# EAGLE design BMS_MCUV1.0 (EAGLE 9.1.3)
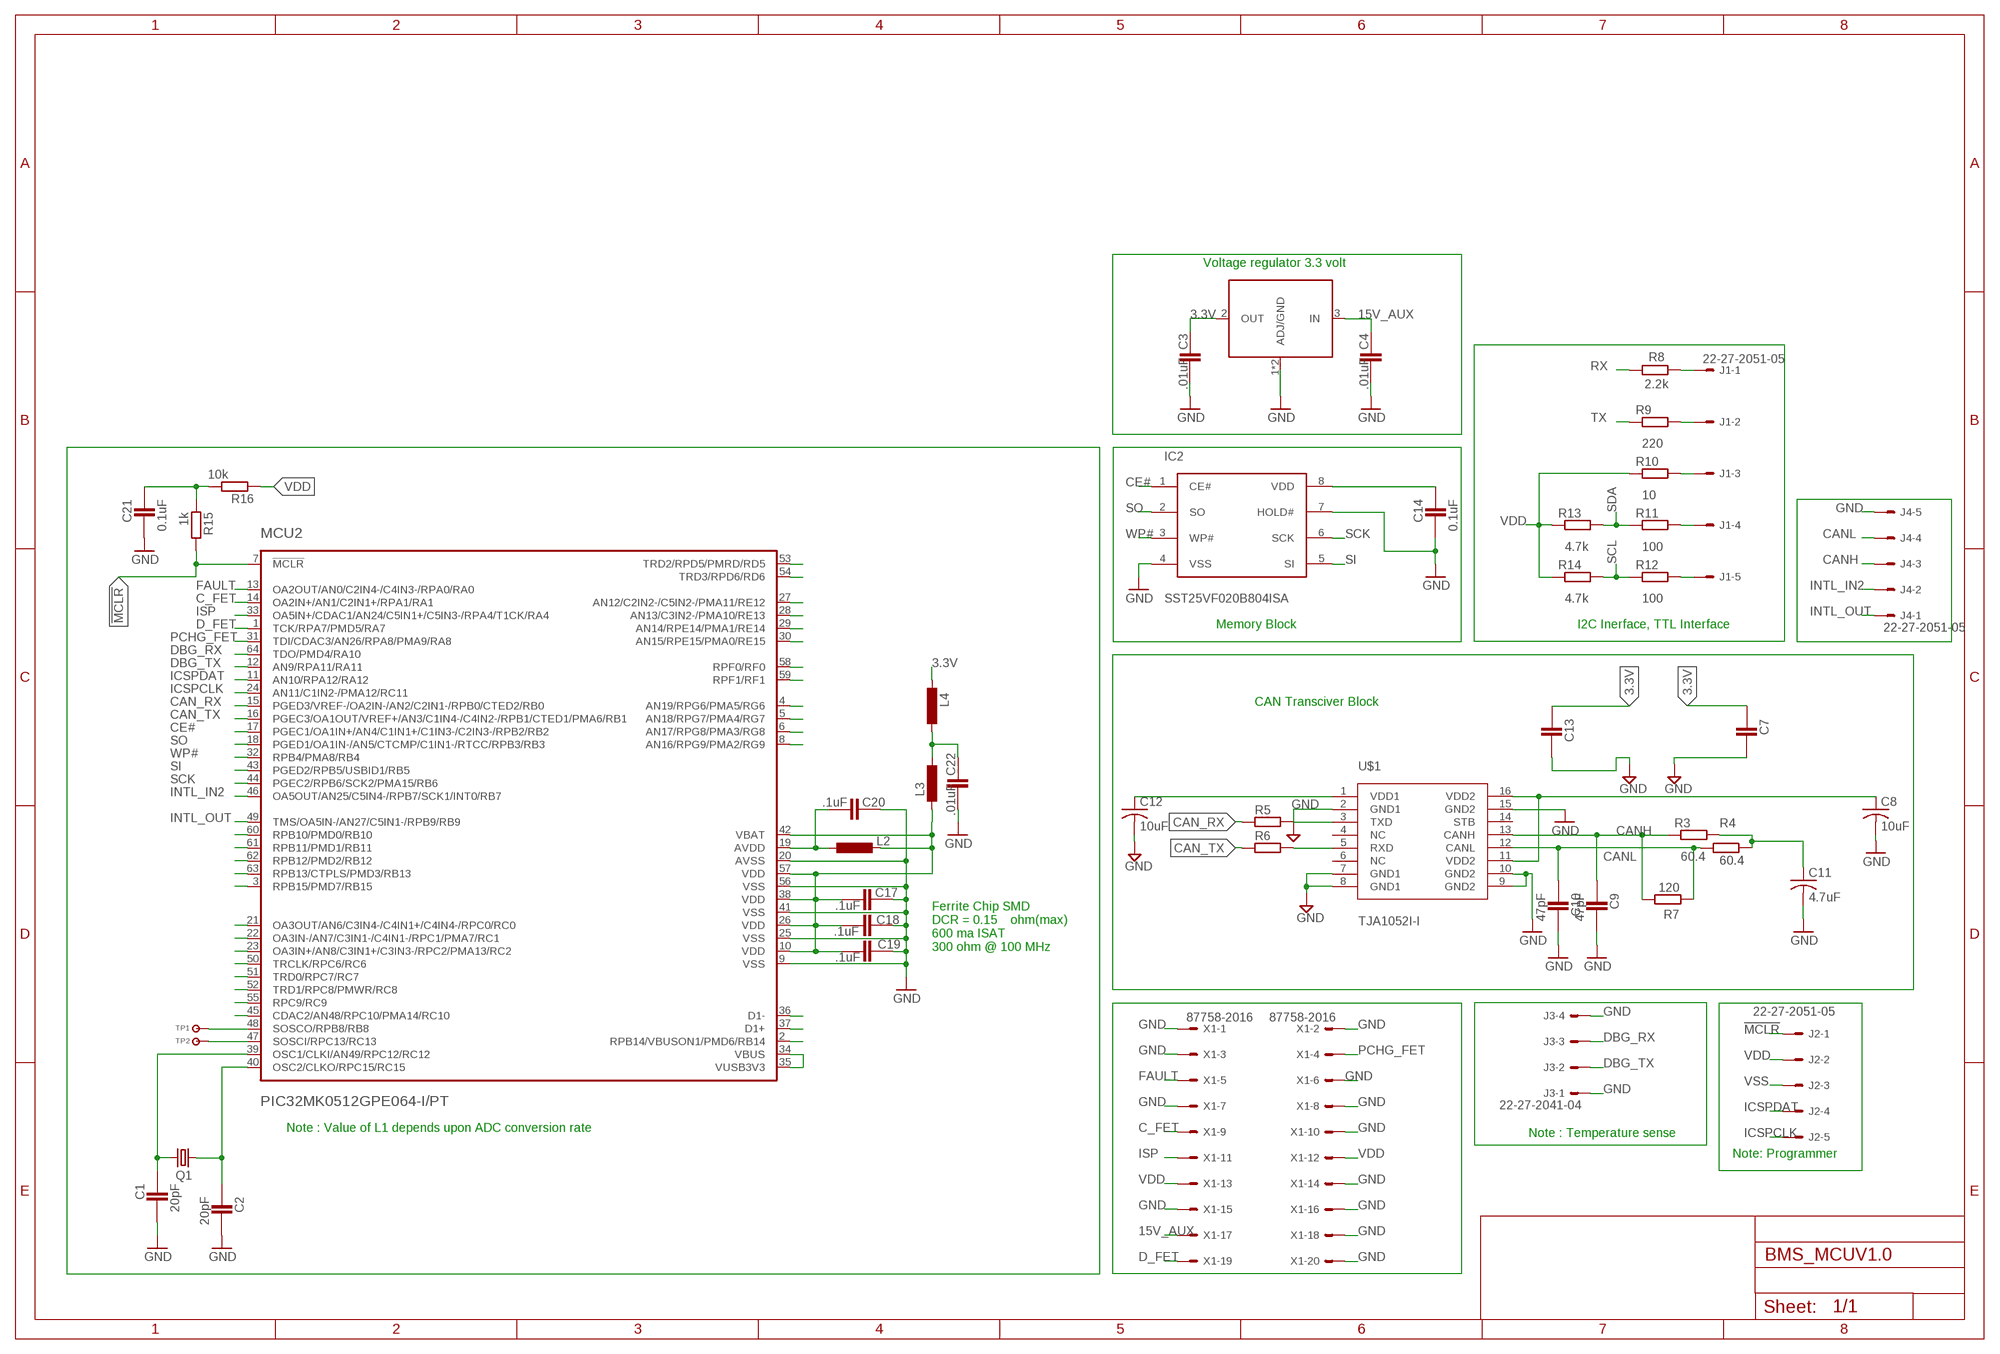
[diagram p0: schematic, sheet 1]

## Parts
C1  20pF  CAPACITOR_0603  [CAPC1608X92N]
C2  20pF  CAPACITOR_0603  [CAPC1608X92N]
C3  .01uF  CAPACITOR_0603  [CAPC1608X92N]
C4  .01uF  CAPACITOR_0603  [CAPC1608X92N]
C7  CAPACITOR_0805  [CAPC2012X145AN]
C8  10uF  C-USC0805  [C0805]
C9  47pF  CAPACITOR_0805  [CAPC2012X145AN]
C10  47pF  CAPACITOR_0805  [CAPC2012X145AN]
C11  4.7uF  C-USC0805  [C0805]
C12  10uF  C-USC0805  [C0805]
C13  CAPACITOR_0805  [CAPC2012X145AN]
C14  0.1uF  CAPACITOR_0603  [CAPC1608X92N]
C17  .1uF  CAPACITOR_0603  [CAPC1608X92N]
C18  .1uF  CAPACITOR_0603  [CAPC1608X92N]
C19  .1uF  CAPACITOR_0603  [CAPC1608X92N]
C20  .1uF  CAPACITOR_0603  [CAPC1608X92N]
C21  0.1uF  CAPACITOR_0603  [CAPC1608X92N]
C22  .01uF  CAPACITOR_0603  [CAPC1608X92N]
IC2  SST25VF020B804ISA  [SOIC127P600X175-8N]
J1  22-27-2051-05  [6410-05]
J2  22-27-2051-05  [6410-05]
J3  22-27-2041-04  [6410-04]
J4  22-27-2051-05  [6410-05]
L2  INDUCTOR_0603  [INDC1608X95N]
L3  INDUCTOR_0603  [INDC1608X95N]
L4  INDUCTOR_0603  [INDC1608X95N]
MCU2  PIC32MK0512GPE064-I/PT  [TQFP-64-I/PT]
Q1  CRYSTALCTS406  [CTS406]
R3  60.4  RESISTOR_0805  [RESC2012X70N]
R4  60.4  RESISTOR_0805  [RESC2012X70N]
R5  RESISTOR_0805  [RESC2012X70N]
R6  RESISTOR_0805  [RESC2012X70N]
R7  120  RESISTOR_0805  [RESC2012X70N]
R8  2.2k  RESISTOR_0805  [RESC2012X70N]
R9  220  RESISTOR_0805  [RESC2012X70N]
R10  10  RESISTOR_0805  [RESC2012X70N]
R11  100  RESISTOR_0805  [RESC2012X70N]
R12  100  RESISTOR_0805  [RESC2012X70N]
R13  4.7k  RESISTOR_0805  [RESC2012X70N]
R14  4.7k  RESISTOR_0805  [RESC2012X70N]
R15  1k  RESISTOR_0603  [RESC1608X55N]
R16  10k  RESISTOR_0603  [RESC1608X55N]
TP1  TP-SMD60  [TP-SMD60]
TP2  TP-SMD60  [TP-SMD60]
U1  NCP1117LP-PG  [SOT-223]
U$1  TJA1052I-I  [SOT162-1]
X1  87758-2016  [87758-2016]

## Nets
3.3V: C3.2 C7.1 C13.1 L4.1 U1.2(OUT)
15V_AUX: C4.2 U1.3(IN) X1.17
!MCLR: J2.1 MCU2.7(!MCLR) R15.2
C_FET: MCU2.14(OA2IN+/AN1/C2IN1+/RPA1/RA1) X1.9
CAN_RX: MCU2.15(PGED3/VREF-/OA2IN-/AN2/C2IN1-/RPB0/CTED2/RB0) R5.1
CAN_TX: MCU2.16(PGEC3/OA1OUT/VREF+/AN3/C1IN4-/C4IN2-/RPB1/CTED1/PMA6/RB1) R6.1
CANH: C9.1 J4.3 R3.1 R7.2 U$1.13(CANH)
CANL: C10.1 J4.4 R4.1 R7.1 U$1.12(CANL)
CE#: IC2.1(CE#) MCU2.17(PGEC1/OA1IN+/AN4/C1IN1+/C1IN3-/C2IN3-/RPB2/RB2)
D_FET: MCU2.1(TCK/RPA7/PMD5/RA7) X1.19
DBG_RX: J3.3 MCU2.64(TDO/PMD4/RA10)
DBG_TX: J3.2 MCU2.12(AN9/RPA11/RA11)
FAULT: MCU2.13(OA2OUT/AN0/C2IN4-/C4IN3-/RPA0/RA0) X1.5
GND: C1.2 C2.2 C3.1 C4.1 C7.2 C8.2 C9.2 C10.2 C11.2 C12.2 C13.2 C14.2 C17.2 C18.2 C19.2 C20.2 C21.2 C22.1 IC2.4(VSS) IC2.7(HOLD#) J3.1 J3.4 J4.5 MCU2.9(VSS) MCU2.20(AVSS) MCU2.25(VSS) MCU2.41(VSS) MCU2.56(VSS) U1.1(ADJ/GND) U1.4(ADJ/GND) U$1.2(GND1) U$1.7(GND1) U$1.8(GND1) U$1.9(GND2) U$1.10(GND2) U$1.15(GND2) X1.1 X1.2 X1.3 X1.6 X1.7 X1.8 X1.10 X1.14 X1.15 X1.16 X1.18 X1.20
ICSPCLK: J2.5 MCU2.24(AN11/C1IN2-/PMA12/RC11)
ICSPDAT: J2.4 MCU2.11(AN10/RPA12/RA12)
INTL_IN2: J4.2 MCU2.46(OA5OUT/AN25/C5IN4-/RPB7/SCK1/INT0/RB7)
INTL_OUT: J4.1 MCU2.49(TMS/OA5IN-/AN27/C5IN1-/RPB9/RB9)
ISP: MCU2.33(OA5IN+/CDAC1/AN24/C5IN1+/C5IN3-/RPA4/T1CK/RA4) X1.11
N$1: C1.1 MCU2.39(OSC1/CLKI/AN49/RPC12/RC12) Q1.3
N$2: C2.1 MCU2.40(OSC2/CLKO/RPC15/RC15) Q1.1
N$5: MCU2.48(SOSCO/RPB8/RB8) TP1.P$1
N$6: R6.2 U$1.5(RXD)
N$7: R5.2 U$1.3(TXD)
N$8: C12.1 U$1.1(VDD1)
N$9: MCU2.53(TRD2/RPD5/PMRD/RD5)
N$10: MCU2.54(TRD3/RPD6/RD6)
N$11: C11.1 R3.2 R4.2
N$12: C8.1 U$1.11(VDD2) U$1.16(VDD2)
N$14: C14.1 IC2.8(VDD)
N$16: MCU2.47(SOSCI/RPC13/RC13) TP2.P$1
N$18: J1.1 R8.2
N$19: J1.2 R9.2
N$20: J1.3 R10.2
N$21: J1.4 R11.2
N$22: J1.5 R12.2
N$29: MCU2.27(AN12/C2IN2-/C5IN2-/PMA11/RE12)
N$30: MCU2.28(AN13/C3IN2-/PMA10/RE13)
N$32: C20.1 L2.1 MCU2.19(AVDD)
N$33: C22.2 L3.2 L4.2
N$34: C21.1 R15.1 R16.2
N$40: MCU2.29(AN14/RPE14/PMA1/RE14)
N$41: MCU2.30(AN15/RPE15/PMA0/RE15)
N$42: MCU2.58(RPF0/RF0)
N$43: MCU2.59(RPF1/RF1)
N$44: MCU2.4(AN19/RPG6/PMA5/RG6)
N$45: MCU2.5(AN18/RPG7/PMA4/RG7)
N$46: MCU2.6(AN17/RPG8/PMA3/RG8)
N$47: MCU2.8(AN16/RPG9/PMA2/RG9)
N$66: MCU2.60(RPB10/PMD0/RB10)
N$67: MCU2.61(RPB11/PMD1/RB11)
N$68: MCU2.62(RPB12/PMD2/RB12)
N$69: MCU2.63(RPB13/CTPLS/PMD3/RB13)
N$70: MCU2.3(RPB15/PMD7/RB15)
N$71: MCU2.21(OA3OUT/AN6/C3IN4-/C4IN1+/C4IN4-/RPC0/RC0)
N$72: MCU2.22(OA3IN-/AN7/C3IN1-/C4IN1-/RPC1/PMA7/RC1)
N$73: MCU2.23(OA3IN+/AN8/C3IN1+/C3IN3-/RPC2/PMA13/RC2)
N$74: MCU2.50(TRCLK/RPC6/RC6)
N$75: MCU2.51(TRD0/RPC7/RC7)
N$76: MCU2.52(TRD1/RPC8/PMWR/RC8)
N$77: MCU2.55(RPC9/RC9)
N$78: MCU2.45(CDAC2/AN48/RPC10/PMA14/RC10)
N$79: MCU2.36(D1-)
N$80: MCU2.37(D1+)
N$81: MCU2.2(RPB14/VBUSON1/PMD6/RB14)
N$82: MCU2.34(VBUS) MCU2.35(VUSB3V3)
PCHG_FET: MCU2.31(TDI/CDAC3/AN26/RPA8/PMA9/RA8) X1.4
RX: R8.1
SCK: IC2.6(SCK) MCU2.44(PGEC2/RPB6/SCK2/PMA15/RB6)
SCL: R12.1 R14.2
SDA: R11.1 R13.2
SI: IC2.5(SI) MCU2.43(PGED2/RPB5/USBID1/RB5)
SO: IC2.2(SO) MCU2.18(PGED1/OA1IN-/AN5/CTCMP/C1IN1-/RTCC/RPB3/RB3)
TX: R9.1
VDD: C17.1 C18.1 C19.1 J2.2 L2.2 L3.1 MCU2.10(VDD) MCU2.26(VDD) MCU2.38(VDD) MCU2.42(VBAT) MCU2.57(VDD) R10.1 R13.1 R14.1 R16.1 X1.12 X1.13
VSS: J2.3
WP#: IC2.3(WP#) MCU2.32(RPB4/PMA8/RB4)
Unconnected: U$1.4(NC) U$1.6(NC) U$1.14(STB)

## Notes on the sheet
- Voltage regulator 3.3 volt
- Memory Block | I2C Inerface, TTL Interface
- CAN Transciver Block
- Ferrite Chip SMD
  DCR = 0.15ȍ ohm(max)
  600 ma ISAT
  300 ohm @ 100 MHz
- Note : Value of L1 depends upon ADC conversion rate
- Note : Temperature sense
- Note: Programmer

## Library data of the parts
C1-C4 C7 C9 C10 C13 C14 C17-C22 = ipc-7351-capacitor:CAPACITOR_
C8 C11 C12 = adafruit:C-US: CAPACITOR, American symbol
IC2 = GreenFuel:SST25VF020B804ISA
J1 J2 J4 = con-molex:22-?-05: CONNECTOR wire to board 2.54 mm (.1 inch) pitch header; MF: MOLEX; OC_FARNELL: unknown; OC_NEWARK: unknown
J3 = con-molex:22-?-04: CONNECTOR wire to board 2.54 mm (.1 inch) pitch header; MF: MOLEX; OC_FARNELL: unknown; OC_NEWARK: unknown
L2-L4 = ipc-7351-inductor:INDUCTOR_
MCU2 = GreenFuel:PIC32MK0512GPE064-I/PT
Q1 = adafruit:CRYSTAL: CRYSTAL; OC_FARNELL: unknown; OC_NEWARK: unknown
R3-R16 = ipc-7351-resistor:RESISTOR_
TP1 TP2 = simpa:TP
U1 = GreenFuel:NCP1117LP
U$1 = GreenFuel:TJA1052I: TJA1052i - Galvanically isolated high-speed CAN transceiver Specification : Type : SOT162-1 Manufacture : NXP Manufacture PN: TJA1052i Certifications: ISO 11898-2:2003 compliant Suitable for use in 12 V and 24 V systems; compatible with 3 V to 5 V microcontrollers Supporting Material TJA1052i Datasheet <https://www.nxp.com/docs/en/data-sheet/TJA1052I.pdf>
X1 = con-molex:87758-2016: 20 Pin - 2mm Dual Row Single Wafer, Vertical T/H HDR Source: http://www.molex.com/pdm_docs/sd/877580616_sd.pdf; MF: MOLEX; MPN: 87758-2016; OC_FARNELL: 7472374; OC_NEWARK: 25M5677

## Board
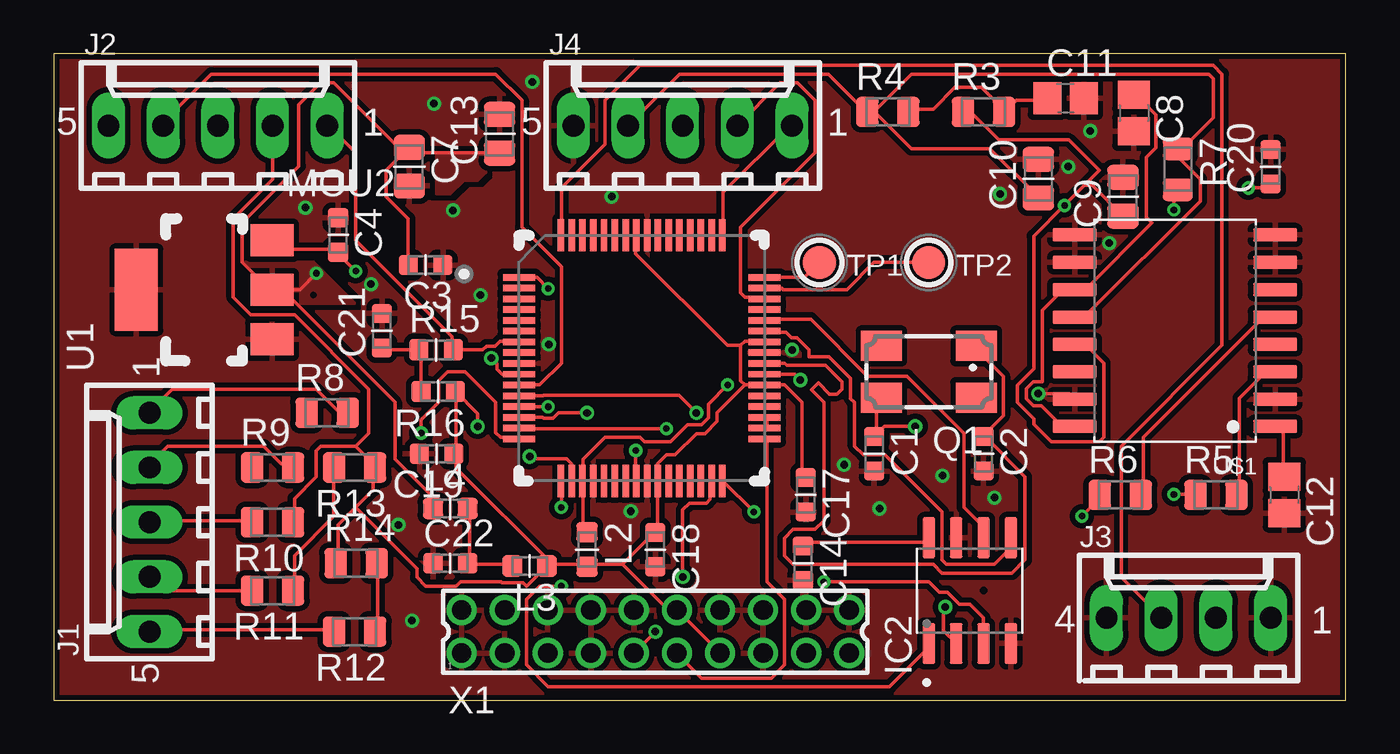
[diagram p1: board, top side]
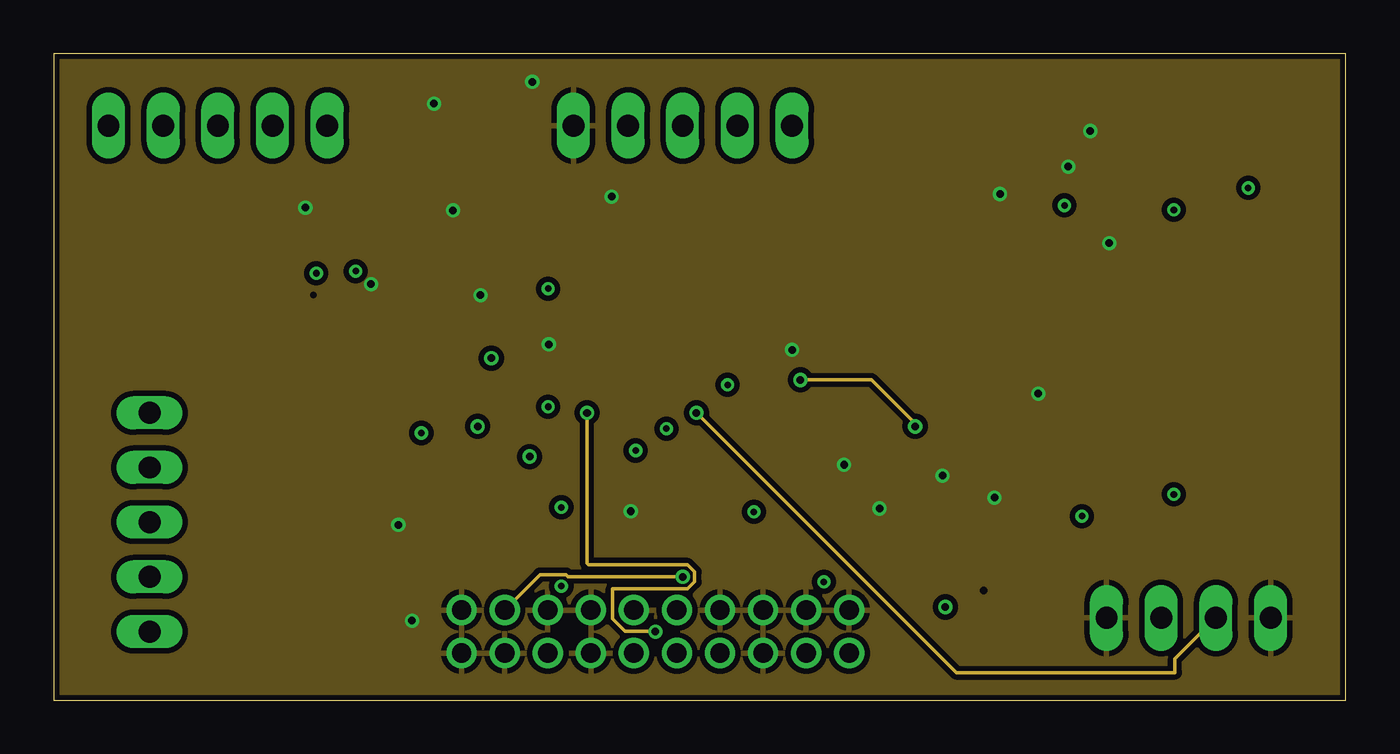
[diagram p2: board, inner layer Route2]
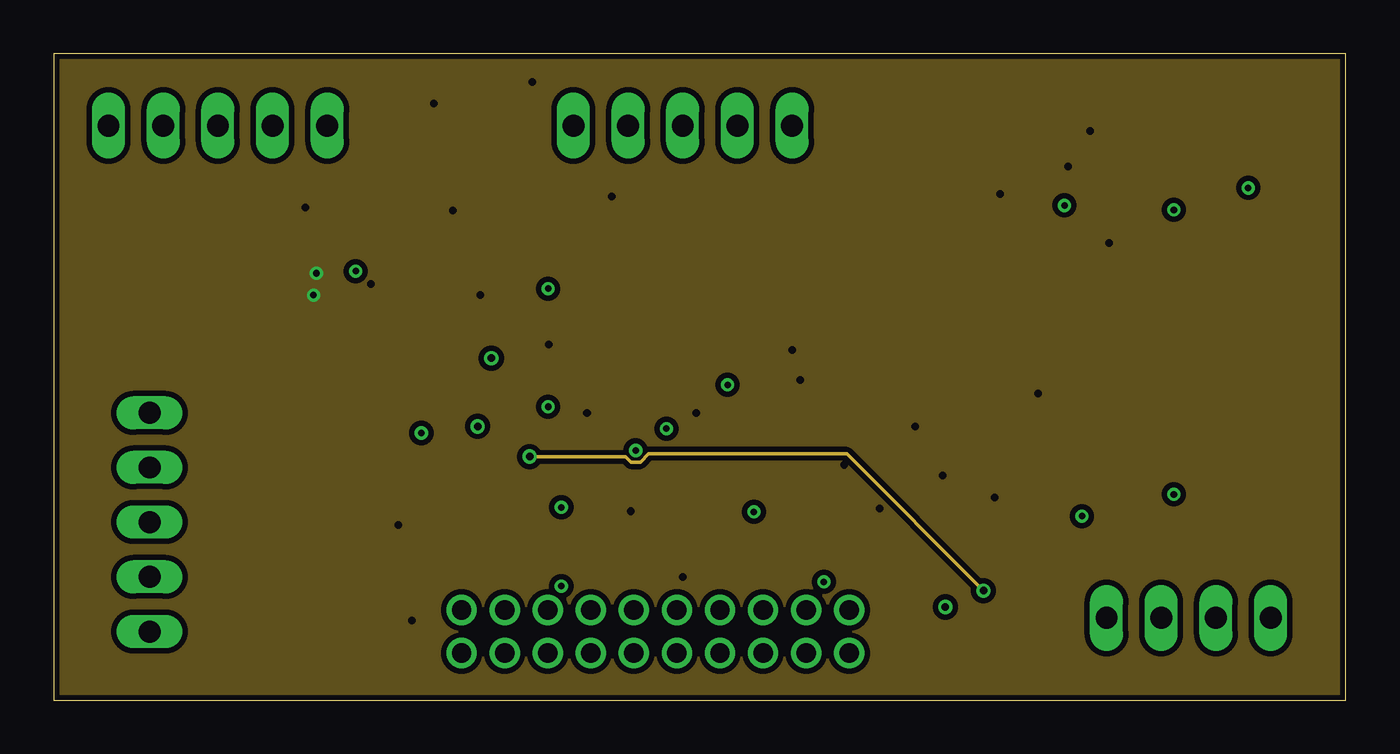
[diagram p3: board, inner layer Route15]
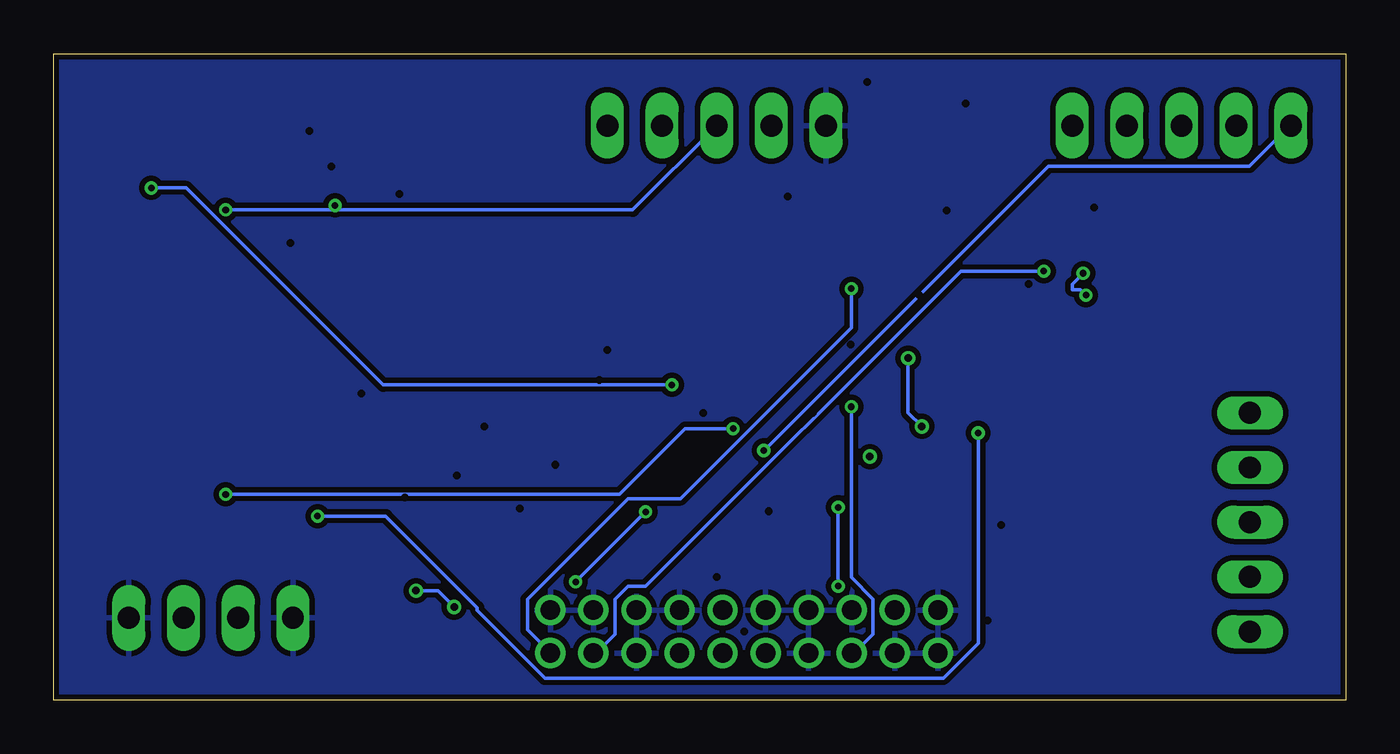
[diagram p4: board, bottom side, seen from below]

Size 60 x 30 mm. Coordinates in mm from the lower left corner, seen from the top.
Outline: 0,0 60,0 60,30 0,30 0,0
Copper layers [15:((1+2)*(15+16)):2]: Top 0.035mm / dielectric 0.09238125mm / Route2 0.035mm / dielectric 1.2304mm / Route15 0.035mm / dielectric 0.09238125mm / Bottom 0.035mm
Design rules "default *": minimum track width 6mil, minimum drill 12mil, track to track 10mil, track to pad 8mil, pad to pad 6mil, via to via 10mil, smd to smd 0mil, copper to edge 10mil, drill to drill 10mil, minimum pad ring 10mil, minimum via ring 6mil, stop-mask expansion 2mil, vias tented up to drill 100mil, thermal gap 10mil

### Footprints (pad centres in the part's own frame; a part is rotated, then mirrored left to right if it is on the bottom)
CAPC1608X92N = smd 0.9 x 0.95: 1 -0.8,0; 2 0.8,0
CAPC2012X145AN = smd 1.15 x 1.45: 1 -0.9,0; 2 0.9,0
C0805 = smd 1.3 x 1.5: 1 -0.85,0; 2 0.85,0
SOIC127P600X175-8N = smd 1.9 x 0.6: 1 -2.455,1.905; 2 -2.455,0.635; 3 -2.455,-0.635; 4 -2.455,-1.905; 5 2.455,-1.905; 6 2.455,-0.635; 7 2.455,0.635; 8 2.455,1.905
6410-05 = drill 1.016 long: 1 5.08,0; 2 2.54,0; 3 0,0; 4 -2.54,0; 5 -5.08,0
6410-04 = drill 1.016 long: 1 3.81,0; 2 1.27,0; 3 -1.27,0; 4 -3.81,0
INDC1608X95N = smd 0.95 x 1: 1 -0.8,0; 2 0.8,0
TQFP-64-I/PT = smd 1.5 x 0.3: 1 -5.7,3.75; 2 -5.7,3.25; 3 -5.7,2.75; 4 -5.7,2.25; 5 -5.7,1.75; 6 -5.7,1.25; 7 -5.7,0.75; 8 -5.7,0.25; 9 -5.7,-0.25; 10 -5.7,-0.75; 11 -5.7,-1.25; 12 -5.7,-1.75; 13 -5.7,-2.25; 14 -5.7,-2.75; 15 -5.7,-3.25; 16 -5.7,-3.75; 33 5.7,-3.75; 34 5.7,-3.25; 35 5.7,-2.75; 36 5.7,-2.25; 37 5.7,-1.75; 38 5.7,-1.25; 39 5.7,-0.75; 40 5.7,-0.25; 41 5.7,0.25; 42 5.7,0.75; 43 5.7,1.25; 44 5.7,1.75; 45 5.7,2.25; 46 5.7,2.75; 47 5.7,3.25; 48 5.7,3.75 | smd 0.3 x 1.5: 17 -3.75,-5.7; 18 -3.25,-5.7; 19 -2.75,-5.7; 20 -2.25,-5.7; 21 -1.75,-5.7; 22 -1.25,-5.7; 23 -0.75,-5.7; 24 -0.25,-5.7; 25 0.25,-5.7; 26 0.75,-5.7; 27 1.25,-5.7; 28 1.75,-5.7; 29 2.25,-5.7; 30 2.75,-5.7; 31 3.25,-5.7; 32 3.75,-5.7; 49 3.75,5.7; 50 3.25,5.7; 51 2.75,5.7; 52 2.25,5.7; 53 1.75,5.7; 54 1.25,5.7; 55 0.75,5.7; 56 0.25,5.7; 57 -0.25,5.7; 58 -0.75,5.7; 59 -1.25,5.7; 60 -1.75,5.7; 61 -2.25,5.7; 62 -2.75,5.7; 63 -3.25,5.7; 64 -3.75,5.7
CTS406 = smd 1.9 x 1.4: 1 -2.2,-1.2; 2 2.2,-1.2; 3 2.2,1.2; 4 -2.2,1.2
RESC2012X70N = smd 1.05 x 1.4: 1 -0.95,0; 2 0.95,0
RESC1608X55N = smd 0.9 x 1: 1 -0.8,0; 2 0.8,0
TP-SMD60 = smd 1.524 x 1.524: P$1 0,0
SOT-223 = smd 1.5 x 2: 1 -2.3,-3.15; 2 0,-3.15; 3 2.3,-3.15 | smd 3.8 x 2: 4 0,3.15
SOT162-1 = smd 2.05 x 0.6: 1 -4.655,4.445; 2 -4.655,3.175; 3 -4.655,1.905; 4 -4.655,0.635; 5 -4.655,-0.635; 6 -4.655,-1.905; 7 -4.655,-3.175; 8 -4.655,-4.445; 9 4.655,-4.445; 10 4.655,-3.175; 11 4.655,-1.905; 12 4.655,-0.635; 13 4.655,0.635; 14 4.655,1.905; 15 4.655,3.175; 16 4.655,4.445
87758-2016 = drill 0.9 pad 1.27: 1 -9,-1; 2 -9,1; 3 -7,-1; 4 -7,1; 5 -5,-1; 6 -5,1; 7 -3,-1; 8 -3,1; 9 -1,-1; 10 -1,1; 11 1,-1; 12 1,1; 13 3,-1; 14 3,1; 15 5,-1; 16 5,1; 17 7,-1; 18 7,1; 19 9,-1; 20 9,1

### Placement (x,y rotation side)
C1  38.1,11.43 270 top
C2  43.18,11.43 270 top
C3  17.27,20.19 180 top
C4  13.21,21.59 270 top
C7  16.51,24.77 270 top
C8  50.16,27.25 270 top
C9  49.66,23.37 90 top
C10  45.72,24.21 90 top
C11  46.99,27.94 0 top
C12  57.15,9.53 270 top
C13  20.7,26.29 90 top
C14  34.8,6.35 270 top
C17  34.92,9.53 270 top
C18  27.94,6.99 270 top
C19  17.78,11.43 180 top
C20  56.52,24.77 90 top
C21  15.24,17.14 90 top
C22  18.41,6.35 0 top
IC2  42.55,5.08 90 top
J1  4.45,8.26 90 top
J2  7.62,26.67 0 top
J3  52.7,3.81 0 top
J4  29.21,26.67 0 top
L2  24.77,6.99 270 top
L3  22.1,6.22 180 top
L4  18.41,8.89 0 top
MCU2  27.3,15.88 0 top
Q1  40.64,15.24 180 top
R3  43.18,27.3 0 top
R4  38.73,27.3 0 top
R5  53.98,9.53 0 top
R6  49.53,9.53 0 top
R7  52.2,24.64 270 top
R8  12.7,13.34 0 top
R9  10.16,10.79 0 top
R10  10.16,8.26 180 top
R11  10.16,5.08 180 top
R12  13.97,3.17 180 top
R13  13.97,10.79 180 top
R14  14.05,6.35 0 top
R15  17.75,16.26 0 top
R16  17.86,14.33 180 top
TP1  35.56,20.32 0 top
TP2  40.64,20.32 0 top
U1  6.99,19.05 90 top
U$1  52.07,17.14 180 top
X1  27.94,3.17 0 top

### Tracks (layer width: path | path; a pad name or v marks a point on that pad's centre or on a via)
3.3V  (via drill 0.3, 0.3 layers 15-16)
  Top 0.152: 16.26,25.4 16.46,25.6 C7.1 | 16.26,25.4 15.44,24.59 15.44,23.37 16.46,22.35 16.46,20.32 C3.2 | C13.1 20.52,25.4 16.87,25.4 16.66,25.6 C7.1 | L4.1 17.48,8.94 17.48,9.55 15.85,11.18 15.85,13.82 10.77,18.9 10.16,18.9 U1.2 | 16.26,25.4 13.01,28.65 12.39,28.65 11.38,27.64 11.38,24.79 8.74,22.15 8.74,20.32 9.96,19.1 U1.2 | 16.26,25.4 C7.1 | U1.2 11.43,19.05 v12.19,19.81
  Bottom 0.152: v12.19,19.81 12.7,19.3 12.7,19.05 12.32,19.05 v12.06,18.8
  pour Route15: 0,0 0,29.97 59.94,29.97 59.94,0
  pour Top: 8.89,20.32 12.06,20.32 13.97,18.41 9.53,18.41 9.53,19.68
  pour Top: 17.78,25.4 17.78,23.5 18.41,23.5 19.05,24.13 19.68,24.13 20.32,24.77 20.32,25.4
15V_AUX  (via drill 0.3)
  Top 0.152: U1.3 10.16,21.34 10.57,20.93 13.21,20.93 C4.2 13.21,20.73 v14.02,19.91
  Bottom 0.152: v14.02,19.91 17.88,19.91 32.51,5.28 33.33,5.28 33.93,4.67 33.93,3.05 34.75,2.23 X1.17
!MCLR
  Top 0.152: MCU2.7 21.54,16.66 20.73,16.66 20.5,16.43 20.09,16.43 19.91,16.26 R15.2 18.49,16.26 18.49,16.87 14.02,21.34 14.02,25.4 12.8,26.62 J2.1
C_FET  (via drill 0.35 layers 1-2)
  Top 0.152: X1.9 v27.94,3.17 | v24.77,13.34 23.44,13.34 23.18,13.08 22.74,13.08 22.7,13.12 MCU2.14
  Route2 0.152: v24.77,13.34 24.77,6.35 24.84,6.27 29.44,6.27 29.77,5.95 29.77,5.49 29.44,5.16 25.96,5.16 25.96,3.77 26.53,3.19 27.92,3.19 v27.94,3.17
CAN_RX  (via drill 0.3)
  Top 0.152: v52.02,9.55 52.83,9.55 R5.1 | v28.45,12.6 21.74,12.6 MCU2.15
  Bottom 0.152: v52.02,9.55 33.73,9.55 30.68,12.6 v28.45,12.6
CAN_TX  (via drill 0.3)
  Top 0.152: v47.75,8.53 48.56,9.35 R6.1 | v17.07,12.39 17.07,13.01 17.88,13.82 17.88,14.83 18.29,15.24 19.1,15.24 20.52,13.82 20.52,12.41 20.74,12.19 21.54,12.19 MCU2.16
  Bottom 0.152: v17.07,12.39 17.07,2.64 18.69,1.02 37.19,1.02 40.34,4.17 40.34,4.29 44.59,8.53 v47.75,8.53
CANH  (via drill 0.3)
  Top 0.152: R3.1 42.27,27.23 42.67,27.23 43.89,26.01 47.14,26.01 48.56,24.59 47.87,23.89 | 47.87,23.89 v46.94,22.96 45.52,21.54 45.52,15.38 44.76,14.62 44.76,13.82 45.52,13.07 45.52,12.8 46.33,11.99 48.56,11.99 48.77,12.19 48.77,15.65 47.95,16.46 47.55,16.46 U$1.13 | v52.02,22.76 52.02,23.55 R7.2 | 47.87,23.89 48.24,23.89 C9.1
  Bottom 0.152: 46.94,22.76 33.12,22.76 J4.3 | 46.94,22.76 v52.02,22.76 | 46.94,22.76 v46.94,22.96
CANL
  Top 0.152: U$1.12 47.55,17.88 47.95,17.88 53.24,23.16 53.24,24.18 52.22,25.2 52.22,25.57 R7.1 52.56,25.81 52.63,25.81 53.85,27.03 53.85,28.85 53.65,29.06 39.83,29.06 38,27.23 | 38,27.23 38.2,27.23 39.83,25.6 43.48,25.6 45.72,23.37 C10.1 | 38,27.23 37.8,27.23 R4.1 | J4.4 29.06,29.06 35.97,29.06 37.59,27.43 R4.1 | 38,27.23 R4.1
CE#  (via drill 0.3)
  Top 0.152: v23.57,8.94 23.57,10.16 MCU2.17 | v23.57,5.28 22.55,5.28 21.95,4.67 21.95,1.63 22.96,0.61 38.81,0.61 40.64,2.44 IC2.1
  Bottom 0.152: v23.57,5.28 v23.57,8.94
D_FET  (via drill 0.3)
  Top 0.152: MCU2.1 22.44,19.62 v22.96,19.1
  Bottom 0.152: v22.96,19.1 22.96,17.27 30.89,9.35 33.33,9.35 38,4.67 38,3.25 36.98,2.23 X1.19
DBG_RX
  Top 0.152: MCU2.64 23.57,21.74 23.57,23.77 25.6,25.81 25.6,27.84 27.23,29.46 53.85,29.46 54.25,29.06 54.25,16.46 49.58,11.79 49.58,5.69 51.41,3.86 J3.3
DBG_TX  (via drill 0.35 layers 1-2)
  Top 0.152: MCU2.12 22.72,14.12 22.74,14.15 29.03,14.15 v29.84,13.34
  Route2 0.152: v29.84,13.34 41.91,1.27 52.07,1.27 52.07,1.91 J3.2
FAULT  (via drill 0.3)
  Top 0.152: MCU2.13 21.74,13.61 v22.96,13.61
  Bottom 0.152: v22.96,13.61 22.96,5.69 21.95,4.67 21.95,3.05 22.76,2.23 X1.5
GND  (via drill 0.35 layers 1-2)
  Top 0.152: U$1.15 47.16,14.22 v45.72,14.22
  other vias: 49.02,21.21 48.13,26.42 47.12,24.77 25.91,23.37 22.23,28.7 17.65,27.69 18.54,22.73 11.68,22.86 19.81,18.8 22.99,16.51 14.73,19.3 16.64,3.68 16,8.13 38.35,8.89 41.27,10.41 43.69,9.4 36.7,10.92 34.29,16.26 26.8,8.76 43.94,23.5
  pour Top (rank 6): 0,0 0,29.97 59.94,29.97 59.94,0
  pour Route2: 0,0 0,29.97 59.94,29.97 59.94,0
  pour Bottom (rank 6): 0,0 0,29.97 59.94,29.97 59.94,0
ICSPCLK  (via drill 0.3)
  Top 0.152: v27.03,11.58 27.03,10.36 MCU2.24
  Bottom 0.152: v27.03,11.58 13.82,24.79 4.47,24.79 2.64,26.62 J2.5
ICSPDAT
  Top 0.152: MCU2.11 21.74,14.63 22.55,14.63 23.57,15.65 23.57,20.12 21.74,21.95 21.74,27.84 20.52,29.06 7.32,29.06 5.08,26.82 J2.4
INTL_IN2
  Top 0.152: J4.2 33.73,28.65 34.54,28.65 35.36,27.84 35.36,25.4 31.9,21.95 31.9,18.9 32.11,18.69 32.92,18.69 MCU2.46
INTL_OUT
  Top 0.152: MCU2.49 31.09,21.74 31.09,23.57 34.14,26.62 J4.1
ISP
  Top 0.152: MCU2.33 33.12,11.99 33.12,5.49 33.93,4.67 33.93,1.63 33.33,1.02 30.07,1.02 29.06,2.03 X1.11
N$1  (via drill 0.35 layers 1-2)
  Top 0.152: Q1.3 38.41,14.02 38.2,13.82 38.2,12.39 C1.1 38.57,12.7 v40.01,12.7 | MCU2.39 34.15,15.12 34.16,15.11 34.42,15.11 v34.67,14.86
  Route2 0.152: v34.67,14.86 37.97,14.86 40.13,12.7 v40.01,12.7
N$2
  Top 0.152: Q1.1 42.88,16.26 44.09,15.04 44.09,13.21 43.28,12.39 C2.1 43.28,12.19 45.11,10.36 45.11,6.5 44.5,5.89 41.25,5.89 40.84,6.3 34.34,6.3 33.93,6.71 33.93,7.52 34.34,7.92 35.36,7.92 35.76,8.33 35.76,13.82 35.18,14.4 35.51,14.72 36.03,14.2 36.36,14.2 36.6,14.44 36.6,14.77 35.84,15.53 34.05,15.53 33.93,15.65 33.12,15.65 MCU2.40
N$5
  Top 0.152: MCU2.48 34.87,19.62 TP1.P$1
N$6
  Top 0.152: R6.2 50.6,9.55 50.6,12.19 56.08,17.68 56.69,17.68 U$1.5
N$7
  Top 0.152: U$1.3 56.29,15.24 55.07,14.02 55.07,9.55 R5.2
N$8
  Top 0.152: C12.1 57.1,10.57 57.1,12.39 56.9,12.6 U$1.1
N$11
  Top 0.152: R4.2 39.83,27.43 40.84,27.43 41.86,28.45 43.08,28.45 44.09,27.43 R3.2 44.3,27.43 44.7,27.84 46.1,27.84 C11.1
N$12
  Top 0.152: U$1.16 47.35,12.8 46.74,12.8 45.87,13.67 45.49,13.67 45.16,13.99 45.16,14.45 45.49,14.78 45.92,14.78 45.92,18.09 46.74,18.9 47.35,18.9 U$1.11 47.55,19.1 47.95,19.1 51,22.15 50.75,22.4 50.75,25.19 51.19,25.64 51.19,27.17 50.26,28.1 C8.1
N$14
  Top 0.152: C14.1 34.95,7.32 40.44,7.32 40.64,7.52 IC2.8
N$16
  Top 0.152: TP2.P$1 38.1,20.32 36.83,19.05 33.88,19.05 33.81,19.11 MCU2.47
N$18
  Top 0.152: R8.2 13.61,13.41 13.21,13.41 12.19,14.43 5.49,14.43 4.47,13.41 J1.1
N$19
  Top 0.152: R9.2 10.97,10.97 10.57,10.97 9.75,11.79 5.28,11.79 4.47,10.97 J1.2
N$20
  Top 0.152: R10.2 9.14,8.33 4.47,8.33 J1.3
N$21
  Top 0.152: R11.2 5.08,5.08 J1.4
N$22
  Top 0.152: R12.2 13.01,3.25 4.47,3.25 J1.5
N$32  (via drill 0.3)
  Top 0.152: v55.47,23.77 56.49,23.77 C20.1 | L2.1 24.59,7.92 24.59,10.16 MCU2.19 24.59,10.36 24.59,11.18 25.6,12.19 27.23,12.19 27.43,11.99 28.65,11.99 29.44,12.78 30.07,12.78 30.4,13.11 30.4,13.74 v31.29,14.63
  Bottom 0.152: v55.47,23.77 53.85,23.77 44.7,14.63 v31.29,14.63
N$33
  Top 0.152: L3.2 21.13,6.3 19.3,6.3 C22.2 19.3,6.5 19.3,8.74 L4.2
N$34
  Top 0.152: C21.1 15.24,16.26 R15.1 17.07,16.26 17.07,14.43 R16.2
N$82
  Top 0.152: MCU2.34 33.12,12.6 33.12,13.01 MCU2.35
PCHG_FET  (via drill 0.35 layers 1-2)
  Top 0.152: v29.21,5.71 29.21,8.83 29.53,9.15 30.32,9.15 30.48,9.31 30.48,10.1 MCU2.31
  Route2 0.152: v29.21,5.71 23.89,5.71 23.79,5.82 22.58,5.82 X1.4
SCK
  Top 0.152: MCU2.44 33.12,17.68 35.15,17.68 37.8,15.04 39.62,15.04 42.27,12.39 42.27,8.94 43.08,8.13 43.08,7.72 IC2.6
SCL
  Top 0.152: R12.1 15.04,3.25 15.04,6.3 R14.2
SDA
  Top 0.152: R11.1 11.18,5.08 11.18,6.71 13.01,8.53 13.01,10.77 R13.2
SI
  Top 0.152: 33.93,17.07 33.66,17.07 | 33.66,17.07 33.12,17.07 MCU2.43 | IC2.5 44.3,7.52 44.3,6.91 43.69,6.3 41.45,6.3 41.25,6.5 41.25,8.74 38.61,11.38 37.59,11.38 37.19,11.79 37.19,13.82 37.01,13.99 37.01,14.94 36.01,15.94 35.06,15.94 35.06,16.27 34.52,16.81 34.27,16.81 34.01,17.07 33.93,17.07 | 33.66,17.07 33.93,17.07
SO  (via drill 0.35, 0.35 layers 15-16)
  Top 0.152: 23.86,11.16 24.05,10.97 MCU2.18 | 23.86,11.16 23.82,11.2 | 23.86,11.16 23.82,11.2 | v22.1,11.3 22.2,11.2 23.82,11.2 | 41.32,3.22 | 41.32,3.22 41.32,4.23 v41.4,4.32 | 41.32,3.22 IC2.2
  Route15 0.152: v43.18,5.08 36.83,11.43 27.63,11.43 27.25,11.05 26.8,11.05 26.55,11.3 v22.1,11.3
  Bottom 0.152: v41.4,4.32 42.16,5.08 v43.18,5.08
VDD  (via drill 0.35)
  Top 0.152: 14.02,8.94 14.83,9.75 14.83,10.77 R13.1 14.83,10.97 14.02,11.79 | 14.02,8.94 13.21,8.13 13.21,6.5 R14.1 | 14.02,11.79 12.39,11.79 12.19,11.58 12.19,10.36 11.18,9.35 11.18,8.33 R10.1 | J2.2 10.16,24.18 8.33,22.35 8.33,18.69 9.14,17.88 11.18,17.88 14.63,14.43 14.63,12.39 14.02,11.79 | C17.1 34.75,10.36 34.75,13.82 33.93,14.63 33.12,14.63 MCU2.38 32.92,14.63 32.11,14.63 | 31.9,16.46 32.11,16.66 32.92,16.66 MCU2.42 | 31.9,16.46 31.9,14.83 32.11,14.63 | 31.9,16.46 31.29,16.46 27.03,20.73 27.03,21.54 MCU2.57 | X1.13 30.89,2.23 29.06,4.06 X1.12 28.85,4.27 28.45,4.27 26.42,6.3 | 23.16,6.3 24.59,6.3 L2.2 24.79,6.3 26.42,6.3 | 23.16,6.3 22.96,6.3 L3.1 | 26.42,6.3 27.84,7.72 C18.1 28.04,7.92 28.04,10.16 MCU2.26 28.04,10.36 28.04,10.97 28.45,11.38 28.85,11.38 29.85,12.37 30.24,12.37 30.81,12.94 30.81,13.33 32.11,14.63 | 23.16,6.3 18.69,10.77 18.69,11.38 C19.1 18.69,11.58 18.69,14.22 R16.1 19.68,13.3 v19.68,12.7 | 23.16,6.3 L3.1 | 14.02,8.94 16.87,6.1 16.87,5.69 17.27,5.28 18.68,5.28 18.88,5.49 20.78,5.49 20.82,5.44 21.79,5.44 21.95,5.28 22.76,6.1 L3.1 | v20.32,15.88 20.58,15.62 20.58,15.36 20.81,15.12 MCU2.10
  Bottom 0.152: v19.68,12.7 20.32,13.34 v20.32,15.88
WP#  (via drill 0.3)
  Top 0.152: v32.51,8.74 31.09,10.16 MCU2.32 | v35.76,5.49 40.64,5.49 41.12,5 41.51,5 42.06,4.45 42.55,4.45 43.18,3.81 IC2.3
  Bottom 0.152: v35.76,5.49 v32.51,8.74